# Altium schematic sheet 5V_EFuse.SchDoc
size A4; SheetNumber: 5; SheetTotal: 5
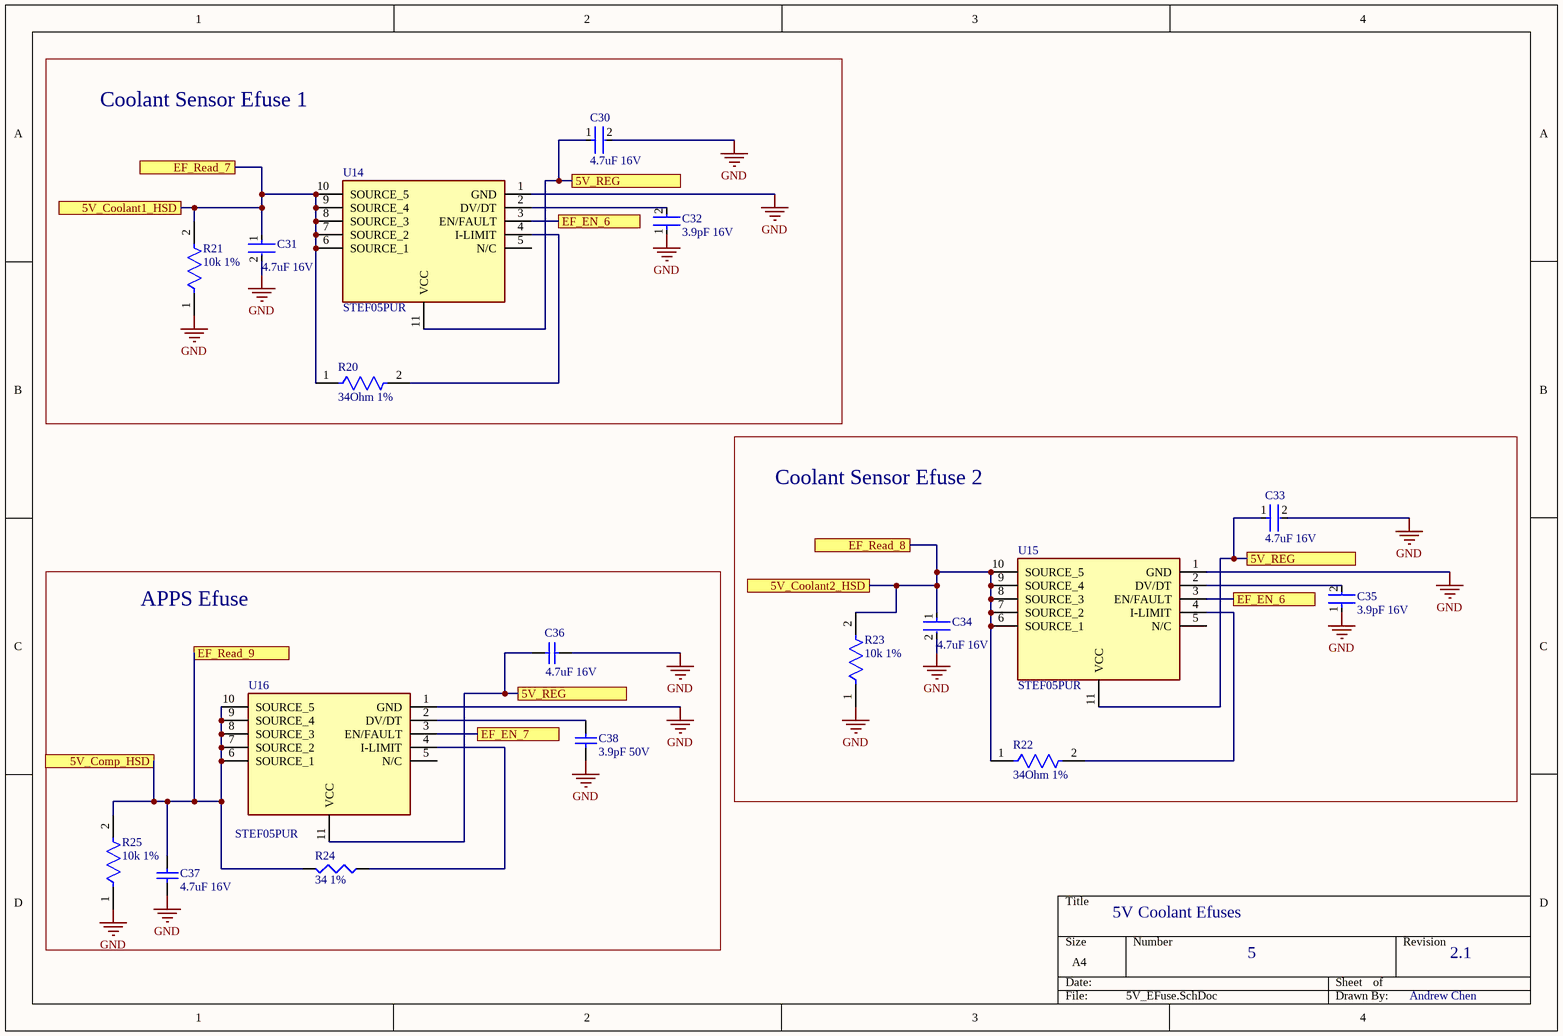
[diagram p0: 5V_EFuse.SchDoc]

## Parts
C30  4.7uF 16V  [FP-CL31-IPC_A]
C31  4.7uF 16V  [FP-CL31-IPC_A]
C32  3.9pF 16V  [FP-CL31-IPC_A]
C33  4.7uF 16V  [FP-CL31-IPC_A]
C34  4.7uF 16V  [FP-CL31-IPC_A]
C35  3.9pF 16V  [FP-CL31-IPC_A]
C36  4.7uF 16V  [C1206]
C37  4.7uF 16V  [C1206]
C38  3.9pF 50V  [C1206]
R20  34Ohm 1%  [FP-CRCW0603-e3-IPC_B]
R21  10k 1%  [FP-CRCW0603-e3-IPC_B]
R22  34Ohm 1%  [FP-CRCW0603-e3-IPC_B]
R23  10k 1%  [FP-CRCW0603-e3-IPC_B]
R24  34 1%  [J1-0603]
R25  10k 1%  [FP-CRCW0603-e3-IPC_B]
U14  STEF05PUR  [SON50P300X300X100-11N-D]
U15  STEF05PUR  [SON50P300X300X100-11N-D]
U16  STEF05PUR  [SON50P300X300X100-11N-D]

## Blocks framed on the sheet
Coolant Sensor Efuse 1: C30-C32 R20 R21 U14
Coolant Sensor Efuse 2: C33-C35 R22 R23 U15
APPS Efuse: C36-C38 R24 R25 U16

## Ports
5V_Comp_HSD, 5V_Coolant1_HSD, 5V_Coolant2_HSD, 5V_REG, EF_EN_6, EF_EN_7, EF_Read_7, EF_Read_8, EF_Read_9

## Nets
GND: C30.2 C31.2 C32.1 C33.2 C34.2 C35.1 C36.2 C37.2 C38.2 R21.1 R23.1 R25.1 U14.1(GND) U15.1(GND) U16.1(GND)
5V_Comp_HSD: C37.1 R24.2 R25.2 U16.6(SOURCE_1) U16.7(SOURCE_2) U16.8(SOURCE_3) U16.9(SOURCE_4) U16.10(SOURCE_5) ; port EF_Read_9, port 5V_Comp_HSD
5V_Coolant1_HSD: C31.1 R20.1 R21.2 U14.6(SOURCE_1) U14.7(SOURCE_2) U14.8(SOURCE_3) U14.9(SOURCE_4) U14.10(SOURCE_5) ; port EF_Read_7, port 5V_Coolant1_HSD
5V_Coolant2_HSD: C34.1 R22.1 R23.2 U15.6(SOURCE_1) U15.7(SOURCE_2) U15.8(SOURCE_3) U15.9(SOURCE_4) U15.10(SOURCE_5) ; port EF_Read_8, port 5V_Coolant2_HSD
5V_REG: C30.1 C33.1 C36.1 U14.11(VCC) U15.11(VCC) U16.11(VCC) ; port 5V_REG
EF_EN_6: U14.3(EN/FAULT) U15.3(EN/FAULT) ; port EF_EN_6
EF_EN_7: U16.3(EN/FAULT) ; port EF_EN_7
NetC32_2: C32.2 U14.2(DV/DT)
NetC35_2: C35.2 U15.2(DV/DT)
NetC38_1: C38.1 U16.2(DV/DT)
NetR20_2: R20.2 U14.4(I-LIMIT)
NetR22_2: R22.2 U15.4(I-LIMIT)
NetR24_1: R24.1 U16.4(I-LIMIT)

Not connected (* = marked no-connect by the designer): U14 5(N/C); U15 5(N/C); U16 5(N/C)

## Notes on the sheet
- 5V Coolant Efuses
- 5
- 2.1
- Andrew Chen

## Library data of the parts
C30-C35 = CMP-13271-002699-1: Cap Ceramic 4.7uF 16V X7R ±10% SMD 1206 +125°C Embossed T/R; Length: 0.126inch; Radiation Hardening: No; Depth: 1.6mm; Min Operating Temperature: -55°C; Mount: Surface Mount; Width: 0.063inch; Thickness: 0.071inch; Case Code (Metric): 3216; Height: 1.6mm; Capacitance: 4.7uF; Package Quantity: 1; Voltage Rating: 16V; Tolerance: 10%; Dielectric: X7R; Packaging: Tape and Reel; Case/Package: 1206; Case Code (Imperial): 1206; Max Operating Temperature: 125°C
C36-C38 = Cap Semi: Capacitor (Semiconductor SIM Model); Value: 22pF; Published: 8-Jun-2000; LatestRevisionDate: 29-May-2009; LatestRevisionNote: IPC-7351 Footprint Added.; PackageReference: C1206; Publisher: Altium Limited; PackageDescription: Chip Capacitor
R20-R23 R25 = CMP-02407-002818-1: RES Thick Film, 18Ω, 1%, 0.1W, 100ppm/°C, 0603; Power Rating: 100mW; Voltage Rating: 75V; Resistance: 18R; Number of Pins: 2; Lead Free: Lead Free; Packaging: Tape and Reel; Tolerance: 1%; Package Quantity: 10; Temperature Coefficient: 100ppm/°C; Features: Automotive AEC-Q200; Depth: 0.85mm; Max Operating Temperature: 155°C; Min Operating Temperature: -55°C; Height: 0.45mm; Length: 1.55mm; Case Code (Metric): 1608; Radiation Hardening: No; Case Code (Imperial): 0603; Termination: SMD/SMT; Mount: Surface Mount; Composition: Thick Film; Max Power Dissipation: 100mW; Weight: 7.1E-05oz; Voltage Rating (DC): 75V; Number of Terminations: 2; Contact Plating: Tin; Width: 0.033inch; Military Standard: Not; Case/Package: 0603
R24 = Res3: Resistor; Value: 220; Published: 8-Jun-2000; LatestRevisionDate: 29-May-2009; LatestRevisionNote: IPC-7351 Footprint Added.; PackageReference: J1-0603; Publisher: Altium Limited; PackageDescription: Chip Resistor
U14-U16 = STEF12EPUR: Integrated Circuit; Manufacturer_Name: STMicroelectronics; Datasheet Link: https://www.arrow.com/en/products/stef12epur/stmicroelectronics; Height: 1mm; Manufacturer_Part_Number: STEF12EPUR; Mouser Part Number: 511-STEF12EPUR; Mouser Price/Stock: https://www.mouser.co.uk/ProductDetail/STMicroelectronics/STEF12EPUR?qs=mKNKSX85ZJfL9n%252BG1BPmuw%3D%3D; Arrow Part Number: STEF12EPUR; Arrow Price/Stock: https://www.arrow.com/en/products/stef12epur/stmicroelectronics